# Altium schematic sheet MDBT42Q - Copy (5).SchDoc
size A4 portrait
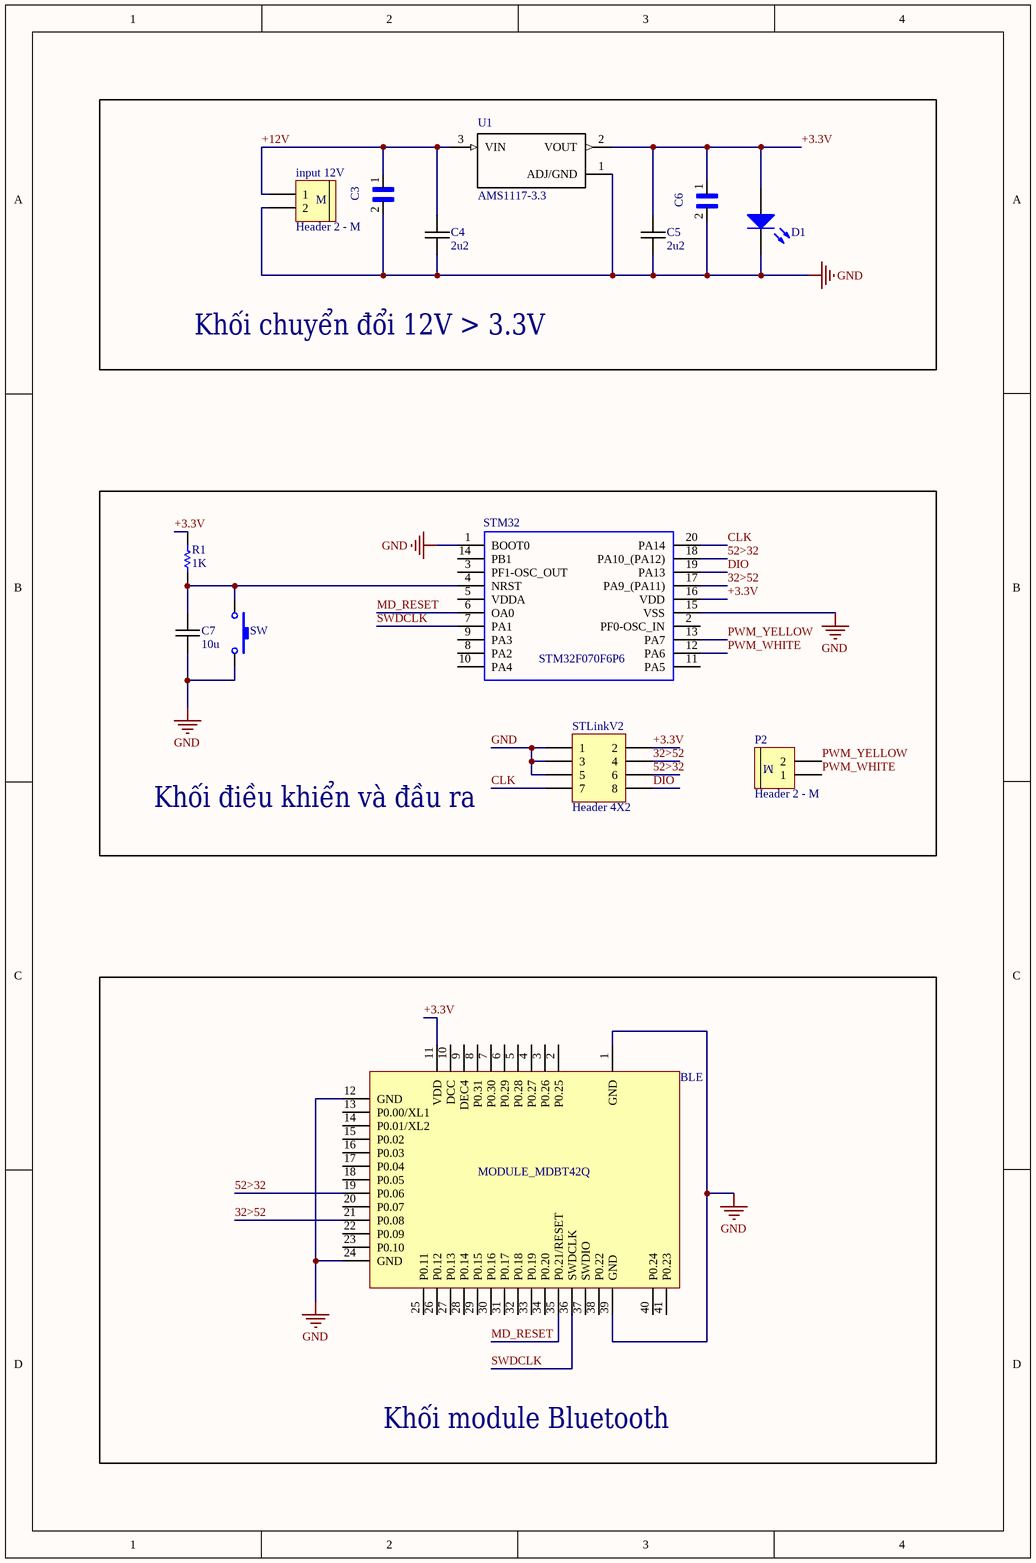
[diagram p0: MDBT42Q - Copy (5).SchDoc]

## Parts
BLE  MODULE_MDBT42Q  [PCB_MDBT42Q_10X16]
C3  C3216X5R1A106K160AB  [CAPC3216X180]  (value not drawn)
C4  2u2  [0805C-GENERIC]
C5  2u2  [0805C-GENERIC]
C6  C3216X5R1A106K160AB  [CAPC3216X180]  (value not drawn)
C7  10u  [0805C-GENERIC]
D1  LED SMD  [LED_0805_Blue]  (value not drawn)
input_12V  Header 2 - M  [Medium - Header 2]
P2  Header 2 - M  [Medium - Header 2]
R1  value 1K  [RES-SM-1206]  (hidden comment: RESISTOR SMD)
STLinkV2  Header 4X2  [HDR2X4]
STM32  STM32F070F6P6  [SOP65P640X120-20N]
SW  SW-SMD  [SW-SMD]  (value not drawn)
U1  AMS1117-3.3  [SOT229P700X180-4N]

## Blocks framed on the sheet
Khối chuyển đổi 12V > 3.3V: C3-C6 D1 input_12V U1
Khối điều khiển và đầu ra: C7 P2 R1 STLinkV2 STM32 SW
Khối module Bluetooth: BLE

## Nets
GND: BLE.1(GND) BLE.12(GND) BLE.24(GND) BLE.39(GND) C3.2 C4.2 C5.2 C6.2 C7.2 D1.2(K) input_12V.2 STLinkV2.1 STLinkV2.3 STLinkV2.5 STM32.1(BOOT0) STM32.15(VSS) SW.2 U1.1(ADJ/GND)
32>52: BLE.21(P0.08) STLinkV2.4 STM32.17(PA9_(PA11))
52>32: BLE.19(P0.06) STLinkV2.6 STM32.18(PA10_(PA12))
+3.3V: BLE.11(VDD) C5.1 C6.1 D1.1(A) R1.2 STLinkV2.2 STM32.16(VDD) U1.2(VOUT)
+12V: C3.1 C4.1 input_12V.1 U1.3(VIN)
CLK: STLinkV2.7 STM32.20(PA14)
DIO: STLinkV2.8 STM32.19(PA13)
MD_RESET: BLE.35(P0.21/RESET) STM32.6(OA0)
PWM_WHITE: P2.1 STM32.12(PA6)
PWM_YELLOW: P2.2 STM32.13(PA7)
SWDCLK: BLE.36(SWDCLK) STM32.7(PA1)
NetC7_1: C7.1 R1.1 STM32.4(NRST) SW.1

Not connected (* = marked no-connect by the designer): BLE 2(P0.25) 3(P0.26) 4(P0.27) 5(P0.28) 6(P0.29) 7(P0.30) 8(P0.31) 9(DEC4) 10(DCC) 13(P0.00/XL1) 14(P0.01/XL2) 15(P0.02) 16(P0.03) 17(P0.04) 18(P0.05) 20(P0.07) 22(P0.09) 23(P0.10) 25(P0.11) 26(P0.12) 27(P0.13) 28(P0.14) 29(P0.15) 30(P0.16) 31(P0.17) 32(P0.18) 33(P0.19) 34(P0.20) 37(SWDIO) 38(P0.22) 40(P0.24) 41(P0.23); STM32 2(PF0-OSC_IN) 3(PF1-OSC_OUT) 5(VDDA) 8(PA2) 9(PA3) 10(PA4) 11(PA5) 14(PB1)

## Notes on the sheet
- (in symbol Header 2 - M) M

## Library data of the parts
BLE = MODULE_MDBT42Q: MDBT42Q
C3 C6 = C3216X5R1A106K160AB: C Series 1206 10 uF 10 V Â±10 % Tolerance X5R SMT Multilayer Ceramic Capacitor; MF: TDK; SnapEDA_Link: https://www.snapeda.com/parts/C3216X5R1A106K160AB/TDK/view-part/?ref=snap; Availability: Unavailable; Price: 0.19 USD; Package: 1206 TDK; MP: C3216X5R1A106K160AB; Value: *
C4 C5 C7 = 0805C-2U2-6V3-X5R-PAN: CAPACITOR 0805 CERAMIC; Manufacturer Part Number: ECJ-1VB0J225K; Manufacturer: Panasonic - ECG; Reel: C7; Supplier 1: Digi-Key; Supplier Part Number 1: PCC2273TR-ND
D1 = LED SMD: LED
input_12V P2 = Header 2 - M: Header, 2-Pin, Medium; LatestRevisionDate: 17-Jul-2002; LatestRevisionNote: Re-released for DXP Platform.; Publisher: Altium Limited
R1 = RESISTOR SMD: Resistor
STLinkV2 = Header 4X2: Header, 4-Pin, Dual row; LatestRevisionDate: 17-Jul-2002; LatestRevisionNote: Re-released for DXP Platform.; Publisher: Altium Limited
STM32 = STM32F070F6P6: STMICROELECTRONICS - STM32F070F6P6 - MCU, 32BIT, CORTEX-M0, 48MHZ, TSSOP-20; Geometry.Height: 1.2mm; Manufacturer_Name: STMicroelectronics; Manufacturer_Part_Number: STM32F070F6P6; RS Part Number: *; RS Price/Stock: *; Arrow Part Number: STM32F070F6P6; Arrow Price/Stock: https://www.arrow.com/en/products/stm32f070f6p6/stmicroelectronics; Datasheet Link: http://www.st.com/content/ccc/resource/technical/document/datasheet/31/4f/10/5f/a5/32/46/42/DM00141386.pdf/files/DM00141386.pdf/jcr:content/translations/en.DM00141386.pdf
SW = SW-SMD: Switch; Published: 24-Mar-1999; LatestRevisionDate: 17-Jul-2002; LatestRevisionNote: Re-released for DXP Platform.; PackageReference: SPST-2; Publisher: Altium Limited
U1 = AMS1117-3.3: Sot223/Pkg 1-Amp 3.3-Volt Low Drop Out Voltage Regulatator; MF: Advanced Monolithic Systems; SnapEDA_Link: https://www.snapeda.com/parts/AMS1117-3.3/Advanced%20Monolithic%20Systems/view-part/?ref=snap; Availability: Unavailable; MP: AMS1117-3.3; Price: None; Package: None; Value: *